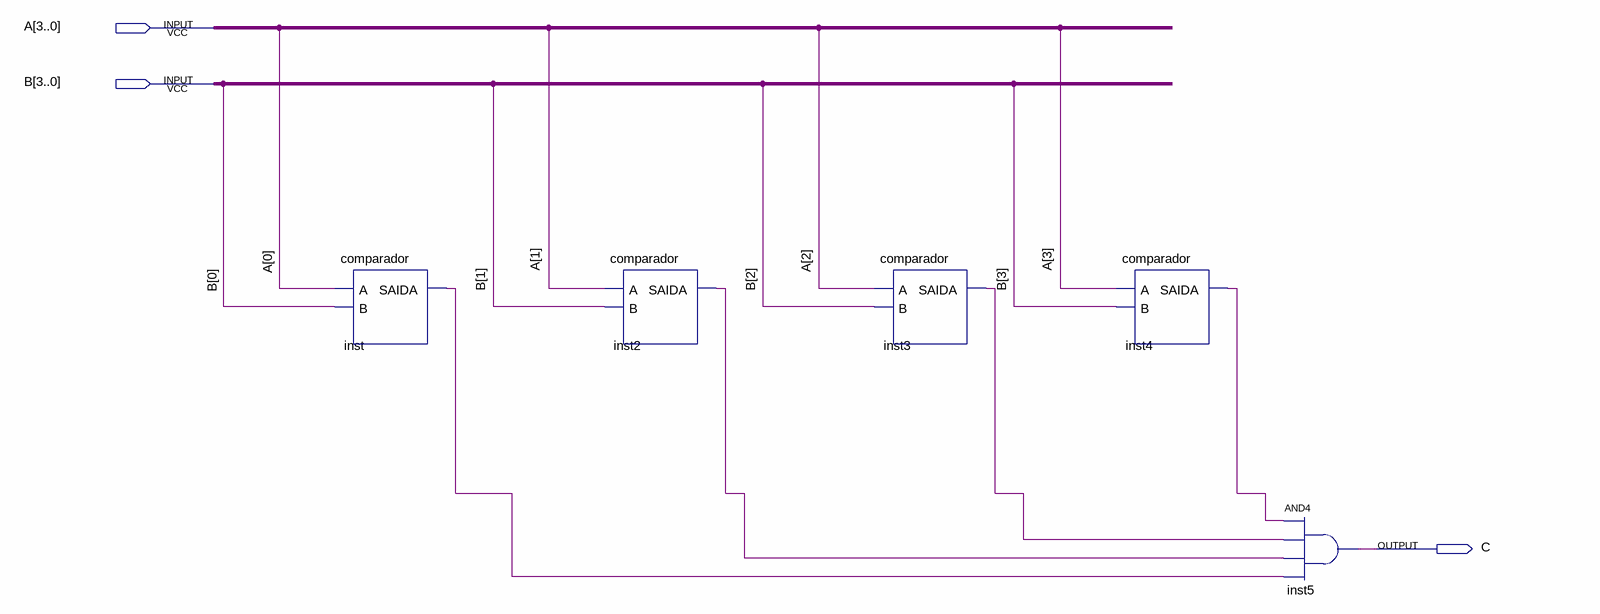
[diagram p0: schematic sheet]
// Quartus schematic comparador4bits.bdf as structural Verilog: 5 symbols, 3 pins
module comparador4bits (
  input  [3:0] A,
  input  [3:0] B,
  output C
);

  wire inst2_saida, inst3_saida, inst4_saida, inst_saida;

  comparador inst (.A(A[0]), .B(B[0]), .SAIDA(inst_saida));
  comparador inst2 (.A(A[1]), .B(B[1]), .SAIDA(inst2_saida));
  comparador inst3 (.A(A[2]), .B(B[2]), .SAIDA(inst3_saida));
  comparador inst4 (.A(A[3]), .B(B[3]), .SAIDA(inst4_saida));
  and inst5 (C, inst4_saida, inst3_saida, inst2_saida, inst_saida);
endmodule
